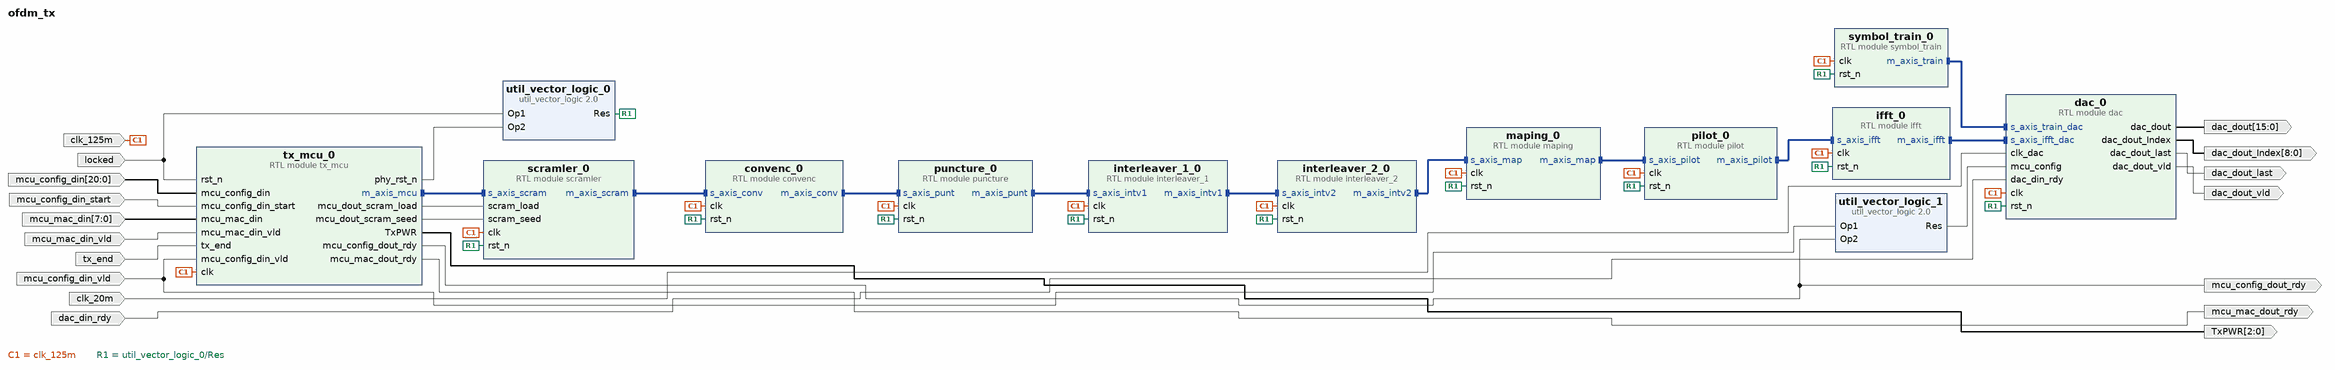
[diagram p0: block diagram of the top level]
# Vivado block design ofdm_tx, xc7k325tffg676-2, Vivado 2023.1
create_bd_design ofdm_tx

create_bd_port -dir I -from 20 -to 0 mcu_config_din
create_bd_port -dir I mcu_config_din_start
create_bd_port -dir I mcu_config_din_vld
create_bd_port -dir O mcu_config_dout_rdy
create_bd_port -dir I -from 7 -to 0 mcu_mac_din
create_bd_port -dir I mcu_mac_din_vld
create_bd_port -dir O mcu_mac_dout_rdy
create_bd_port -dir O -from 2 -to 0 TxPWR
create_bd_port -dir I tx_end
create_bd_port -dir O -from 15 -to 0 dac_dout
create_bd_port -dir O dac_dout_last
create_bd_port -dir O -from 8 -to 0 dac_dout_Index
create_bd_port -dir O dac_dout_vld
create_bd_port -dir I dac_din_rdy
create_bd_port -dir I -type clk clk_125m
set_property -dict {CONFIG.FREQ_HZ 125000000} [get_bd_ports clk_125m]
create_bd_port -dir I clk_20m
create_bd_port -dir I -type rst locked

create_bd_cell -type module -reference interleaver_2 interleaver_2_0
create_bd_cell -type module -reference interleaver_1 interleaver_1_0
create_bd_cell -type module -reference convenc convenc_0
create_bd_cell -type module -reference scramler scramler_0
create_bd_cell -type module -reference maping maping_0
create_bd_cell -type module -reference puncture puncture_0
create_bd_cell -type module -reference symbol_train symbol_train_0
create_bd_cell -type module -reference pilot pilot_0
create_bd_cell -type module -reference ifft ifft_0
create_bd_cell -type ip -vlnv xilinx.com:ip:util_vector_logic:2.0 util_vector_logic_0
set_property -dict {CONFIG.C_SIZE 1} [get_bd_cells util_vector_logic_0]
create_bd_cell -type module -reference tx_mcu tx_mcu_0
create_bd_cell -type ip -vlnv xilinx.com:ip:util_vector_logic:2.0 util_vector_logic_1
set_property -dict {CONFIG.C_SIZE 1} [get_bd_cells util_vector_logic_1]
create_bd_cell -type module -reference dac dac_0

# ---- connections ----

connect_bd_intf_net [get_bd_intf_pins convenc_0/m_axis_conv] [get_bd_intf_pins puncture_0/s_axis_punt]
connect_bd_intf_net [get_bd_intf_pins ifft_0/m_axis_ifft] [get_bd_intf_pins dac_0/s_axis_ifft_dac]
connect_bd_intf_net [get_bd_intf_pins interleaver_1_0/m_axis_intv1] [get_bd_intf_pins interleaver_2_0/s_axis_intv2]
connect_bd_intf_net [get_bd_intf_pins interleaver_2_0/m_axis_intv2] [get_bd_intf_pins maping_0/s_axis_map]
connect_bd_intf_net [get_bd_intf_pins maping_0/m_axis_map] [get_bd_intf_pins pilot_0/s_axis_pilot]
connect_bd_intf_net [get_bd_intf_pins pilot_0/m_axis_pilot] [get_bd_intf_pins ifft_0/s_axis_ifft]
connect_bd_intf_net [get_bd_intf_pins puncture_0/m_axis_punt] [get_bd_intf_pins interleaver_1_0/s_axis_intv1]
connect_bd_intf_net [get_bd_intf_pins scramler_0/m_axis_scram] [get_bd_intf_pins convenc_0/s_axis_conv]
connect_bd_intf_net [get_bd_intf_pins symbol_train_0/m_axis_train] [get_bd_intf_pins dac_0/s_axis_train_dac]
connect_bd_intf_net [get_bd_intf_pins tx_mcu_0/m_axis_mcu] [get_bd_intf_pins scramler_0/s_axis_scram]
connect_bd_net -net clk_0_1 [get_bd_ports clk_125m] \
  [get_bd_pins convenc_0/clk] [get_bd_pins scramler_0/clk] [get_bd_pins puncture_0/clk] [get_bd_pins ifft_0/clk] \
  [get_bd_pins pilot_0/clk] [get_bd_pins interleaver_1_0/clk] [get_bd_pins interleaver_2_0/clk] [get_bd_pins maping_0/clk] \
  [get_bd_pins symbol_train_0/clk] [get_bd_pins tx_mcu_0/clk] [get_bd_pins dac_0/clk]
connect_bd_net -net clk_dac_0_1 [get_bd_ports clk_20m] [get_bd_pins dac_0/clk_dac]
connect_bd_net [get_bd_pins dac_0/dac_dout] [get_bd_ports dac_dout]
connect_bd_net [get_bd_pins dac_0/dac_dout_Index] [get_bd_ports dac_dout_Index]
connect_bd_net [get_bd_pins dac_0/dac_dout_last] [get_bd_ports dac_dout_last]
connect_bd_net [get_bd_pins dac_0/dac_dout_vld] [get_bd_ports dac_dout_vld]
connect_bd_net -net dac_din_rdy_0_1 [get_bd_ports dac_din_rdy] [get_bd_pins dac_0/dac_din_rdy]
connect_bd_net -net mcu_config_din_0_1 [get_bd_ports mcu_config_din] [get_bd_pins tx_mcu_0/mcu_config_din]
connect_bd_net -net mcu_config_din_start_0_1 [get_bd_ports mcu_config_din_start] [get_bd_pins tx_mcu_0/mcu_config_din_start]
connect_bd_net -net mcu_config_din_vld_0_1 [get_bd_ports mcu_config_din_vld] \
  [get_bd_pins tx_mcu_0/mcu_config_din_vld] [get_bd_pins util_vector_logic_1/Op1]
connect_bd_net -net mcu_mac_din_0_1 [get_bd_ports mcu_mac_din] [get_bd_pins tx_mcu_0/mcu_mac_din]
connect_bd_net -net mcu_mac_din_vld_0_1 [get_bd_ports mcu_mac_din_vld] [get_bd_pins tx_mcu_0/mcu_mac_din_vld]
connect_bd_net -net rst_n_0_1 [get_bd_ports locked] [get_bd_pins util_vector_logic_0/Op1] [get_bd_pins tx_mcu_0/rst_n]
connect_bd_net -net tx_end_0_1 [get_bd_ports tx_end] [get_bd_pins tx_mcu_0/tx_end]
connect_bd_net [get_bd_pins tx_mcu_0/TxPWR] [get_bd_ports TxPWR]
connect_bd_net [get_bd_pins tx_mcu_0/mcu_config_dout_rdy] [get_bd_ports mcu_config_dout_rdy] [get_bd_pins util_vector_logic_1/Op2]
connect_bd_net [get_bd_pins tx_mcu_0/mcu_dout_scram_load] [get_bd_pins scramler_0/scram_load]
connect_bd_net [get_bd_pins tx_mcu_0/mcu_dout_scram_seed] [get_bd_pins scramler_0/scram_seed]
connect_bd_net [get_bd_pins tx_mcu_0/mcu_mac_dout_rdy] [get_bd_ports mcu_mac_dout_rdy]
connect_bd_net [get_bd_pins tx_mcu_0/phy_rst_n] [get_bd_pins util_vector_logic_0/Op2]
connect_bd_net [get_bd_pins util_vector_logic_0/Res] \
  [get_bd_pins scramler_0/rst_n] [get_bd_pins convenc_0/rst_n] [get_bd_pins puncture_0/rst_n] \
  [get_bd_pins interleaver_1_0/rst_n] [get_bd_pins interleaver_2_0/rst_n] [get_bd_pins maping_0/rst_n] \
  [get_bd_pins pilot_0/rst_n] [get_bd_pins symbol_train_0/rst_n] [get_bd_pins ifft_0/rst_n] [get_bd_pins dac_0/rst_n]
connect_bd_net [get_bd_pins util_vector_logic_1/Res] [get_bd_pins dac_0/mcu_config]

validate_bd_design
save_bd_design
